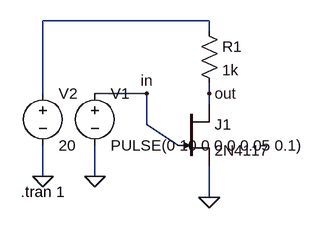
[diagram p0: schematic Draft8.asc]
Draft8.asc, the LTspice schematic file:
Version 4
SHEET 1 880 680
WIRE 256 32 0 32
WIRE 256 48 256 32
WIRE 0 144 0 32
WIRE 160 144 80 144
WIRE 256 144 256 128
WIRE 256 160 256 144
WIRE 160 192 160 144
WIRE 208 224 160 192
WIRE 0 272 0 224
WIRE 80 272 80 224
WIRE 256 304 256 256
FLAG 80 272 0
FLAG 0 272 0
FLAG 256 304 0
FLAG 256 144 out
FLAG 160 144 in
SYMBOL voltage 80 128 R0
WINDOW 123 0 0 Left 0
WINDOW 39 0 0 Left 0
SYMATTR InstName V1
SYMATTR Value PULSE(0 10 0 0 0 0.05 0.1)
SYMBOL voltage 0 128 R0
WINDOW 123 0 0 Left 0
WINDOW 39 0 0 Left 0
SYMATTR InstName V2
SYMATTR Value 20
SYMBOL res 240 32 R0
SYMATTR InstName R1
SYMATTR Value 1k
SYMBOL njf 208 160 R0
SYMATTR InstName J1
SYMATTR Value 2N4117
TEXT -34 296 Left 2 !.tran 1

The netlist it stands for:
* Draft8.asc
V1 in 0 PULSE(0 10 0 0 0 0.05 0.1)
V2 N001 0 20
R1 N001 out 1k
J1 out in 0 2N4117
.model NJF NJF
.model PJF PJF
.lib standard.jft
.tran 1
.backanno
.end